# Altium schematic sheet vcsample.schdoc
size 200 x 120 mm
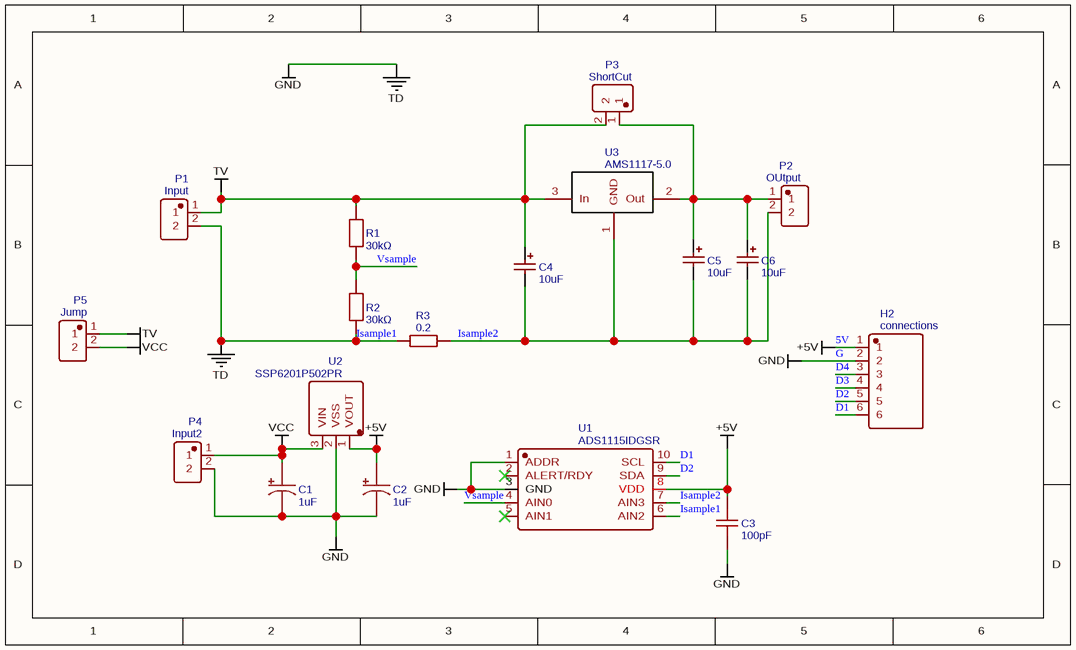
[diagram p0: vcsample.schdoc]

## Parts
C1  1uF  [CAP-SMD_L3.2-W1.6-R-RD]
C2  1uF  [CAP-SMD_L3.2-W1.6-R-RD]
C3  100pF  [C0402]
C4  10uF  [CAP-SMD_L3.5-W2.8-R-RD]
C5  10uF  [CAP-SMD_L3.5-W2.8-R-RD]
C6  10uF  [CAP-SMD_L3.5-W2.8-R-RD]
H2  connections  [HDR-TH_6P-P2.54-H-W10.3]
P1  Input  [HDR-TH_2P-P2.00-V]
P2  OUtput  [HDR-TH_2P-P2.00-V]
P3  ShortCut  [HDR-TH_2P-P2.00-V]
P4  Input2  [HDR-TH_2P-P2.00-V]
P5  Jump  [HDR-TH_2P-P2.00-V]
R1  30kΩ  [R0805]
R2  30kΩ  [R0805]
R3  0.2  [R0805]
U1  ADS1115IDGSR  [MSOP-10_L3.0-W3.0-P0.50-LS5.0-BL]
U2  SSP6201P502PR  [SOT-89_L4.5-W2.5-P1.50-LS4.2-BR]
U3  AMS1117-5.0  [SOT-223]

## Nets
5V: C2.1 C3.1 H2.1 U1.8(VDD) U2.1(VOUT)  [also labelled +5V]
G: C1.2 C2.2 C3.2 H2.2 P1.2 P4.2 R2.2 R3.1 U1.1(ADDR) U1.3(GND) U1.6(AIN2) U2.2(VSS)  [also labelled GND, Isample1, TD]
TV: C4.1 P1.1 P3.2 P5.1 R1.1 U3.3(In)
VCC: C1.1 P4.1 P5.2 U2.3(VIN)
D1: H2.6 U1.10(SCL)
D2: H2.5 U1.9(SDA)
D3: H2.4
D4: H2.3
Isample2: C4.2 C5.2 C6.2 P2.2 R3.2 U1.7(AIN3) U3.1(GND)
Vsample: R1.2 R2.1 U1.4(AIN0)
NetC5_1: C5.1 C6.1 P2.1 P3.1 U3.2(Out)

Not connected (* = marked no-connect by the designer): U1 2(ALERT/RDY)* 5(AIN1)*

## Library data of the parts
C1 C2 = 1uF: BOM_Manufacturer: Sunlord; BOM_Manufacturer Part: TC212A105K025Y; nameAlias: Capacitance; Contributor: LCSC; SMT Type: Extend; BOM_Supplier: LCSC; BOM_Supplier Part: C165110; BOM_JLCPCB SMD: Yes; spicePre: C; spiceSymbolName: TC212A105K025Y
C3 = 100pF: BOM_Manufacturer: YAGEO; BOM_Manufacturer Part: CC0402JRNPO7BN101; nameAlias: Capacitance; Contributor: LCSC; BOM_Supplier: LCSC; BOM_Supplier Part: C526991; spicePre: C; spiceSymbolName: CC0402JRNPO7BN101
C4-C6 = 10uF: BOM_Manufacturer: AVX; BOM_Manufacturer Part: TAJB106K020RNJ; nameAlias: Capacitance; SMT Type: Extend; BOM_Supplier: LCSC; BOM_Supplier Part: C8017; BOM_JLCPCB SMD: Yes; spicePre: C; spiceSymbolName: TAJB106K020RNJ
H2 = connections: BOM_Manufacturer: Changjiang Connectors; BOM_Manufacturer Part: A2541WR-6P; Contributor: LCSC; BOM_Supplier: LCSC; BOM_Supplier Part: C225492; spicePre: H; spiceSymbolName: A2541WR-6P
P1 = Input: BOM_Manufacturer: BOOMELE; BOM_Manufacturer Part: Female header1*2P; BOM_Supplier: LCSC; BOM_Supplier Part: C66509; spicePre: P; spiceSymbolName: Female header1*2P
P2 = OUtput: BOM_Manufacturer: BOOMELE; BOM_Manufacturer Part: Female header1*2P; BOM_Supplier: LCSC; BOM_Supplier Part: C66509; spicePre: P; spiceSymbolName: Female header1*2P
P3 = ShortCut: BOM_Manufacturer: BOOMELE; BOM_Manufacturer Part: Female header1*2P; BOM_Supplier: LCSC; BOM_Supplier Part: C66509; spicePre: P; spiceSymbolName: Female header1*2P
P4 = Input2: BOM_Manufacturer: BOOMELE; BOM_Manufacturer Part: Female header1*2P; BOM_Supplier: LCSC; BOM_Supplier Part: C66509; spicePre: P; spiceSymbolName: Female header1*2P
P5 = Jump: BOM_Manufacturer: BOOMELE; BOM_Manufacturer Part: Female header1*2P; BOM_Supplier: LCSC; BOM_Supplier Part: C66509; spicePre: P; spiceSymbolName: Female header1*2P
R1 R2 = 30kΩ: BOM_Manufacturer: UNI-ROYAL(Uniroyal Elec); BOM_Manufacturer Part: TC0550B3002T5J; nameAlias: Resistance (Ohms); Contributor: LCSC; BOM_Supplier: LCSC; BOM_Supplier Part: C517551; spicePre: R; spiceSymbolName: TC0550B3002T5J
R3 = 0.2: BOM_Manufacturer: Uniroyal Elec; BOM_Manufacturer Part: 0805W4F200LT5E; nameAlias: Resistance (Ohms); Contributor: LCSC; BOM_Supplier: LCSC; BOM_Supplier Part: C270925; spicePre: R; spiceSymbolName: 0805W4F200LT5E
U1 = ADS1115IDGSR: BOM_Manufacturer: TI; SMT Type: Extend; BOM_Supplier: LCSC; BOM_Manufacturer Part: ADS1115IDGSR; image: //image.lceda.cn/szlcsc/C37593.jpg; BOM_Supplier Part: C37593; BOM_JLCPCB SMD: Yes; spicePre: U; spiceSymbolName: ADS1115IDGSR
U2 = SSP6201P502PR: BOM_Manufacturer: Shanghai Siproin Microelectronics; Contributor: LCSC; BOM_Supplier: LCSC; BOM_Supplier Part: C330932; BOM_Manufacturer Part: SSP6201P502PR; spicePre: U; spiceSymbolName: SSP6201P502PR
U3 = AMS1117-5.0: BOM_Manufacturer: AMS; sourceId: HltLFyQwq; timeStamp: 1466676067; BOM_Supplier Part: C6187; BOM_Supplier: LCSC; BOM_Manufacturer Part: AMS1117-5.0; BOM_LCSC Assembly: Yes; spicePre: U; spiceSymbolName: AMS1117-5.0